# Altium schematic sheet DebugCircuit.SchDoc
size A; SheetNumber: 7; SheetTotal: 8
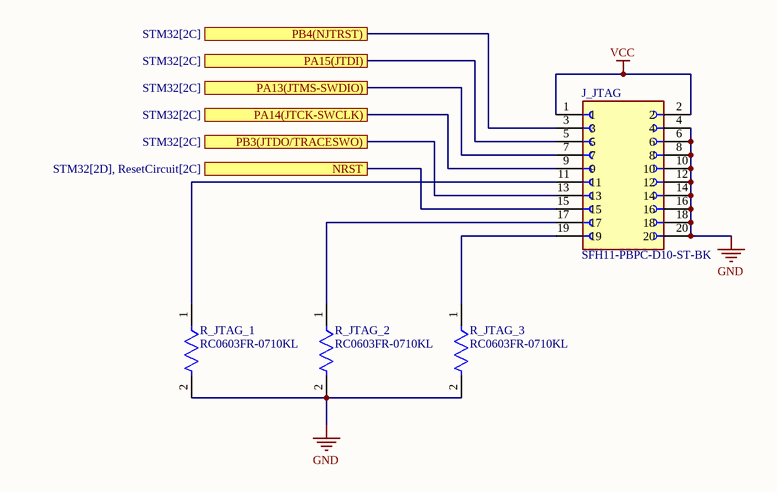
[diagram p0: DebugCircuit.SchDoc]

## Parts
J_JTAG  SFH11-PBPC-D10-ST-BK  [SULLINS_SFH11-PBPC-D10-ST-BK]
R_JTAG_1  RC0603FR-0710KL  [FP-RC0603-0_55-IPC_C]
R_JTAG_2  RC0603FR-0710KL  [FP-RC0603-0_55-IPC_C]
R_JTAG_3  RC0603FR-0710KL  [FP-RC0603-0_55-IPC_C]

## Ports
NRST (see STM32[2D], ResetCircuit[2C]), PA13(JTMS-SWDIO) (see STM32[2C]), PA14(JTCK-SWCLK) (see STM32[2C]), PA15(JTDI) (see STM32[2C]), PB3(JTDO/TRACESWO) (see STM32[2C]), PB4(NJTRST) (see STM32[2C])

## Nets
GND: J_JTAG.4 J_JTAG.6 J_JTAG.8 J_JTAG.10 J_JTAG.12 J_JTAG.14 J_JTAG.16 J_JTAG.18 J_JTAG.20 R_JTAG_1.2 R_JTAG_2.2 R_JTAG_3.2
VCC: J_JTAG.1 J_JTAG.2
NRST: J_JTAG.15 ; port NRST
PA13(JTMS-SWDIO): J_JTAG.7 ; port PA13(JTMS-SWDIO)
PA14(JTCK-SWCLK): J_JTAG.9 ; port PA14(JTCK-SWCLK)
PA15(JTDI): J_JTAG.5 ; port PA15(JTDI)
PB3(JTDO/TRACESWO): J_JTAG.13 ; port PB3(JTDO/TRACESWO)
PB4(NJTRST): J_JTAG.3 ; port PB4(NJTRST)
NetJ_JTAG_11: J_JTAG.11 R_JTAG_1.1
NetJ_JTAG_17: J_JTAG.17 R_JTAG_2.1
NetJ_JTAG_19: J_JTAG.19 R_JTAG_3.1

## Library data of the parts
J_JTAG = SFH11-PBPC-D10-ST-BK: 20 Position Header Connector 0.100 (2.54mm) Through Hole Gold; MF: Sullins Connector; Package: None; Price: None; Check_prices: https://www.snapeda.com/parts/SFH11-PBPC-D10-ST-BK/Sullins+Connector+Solutions/view-part/?ref=eda; Value: *; SnapEDA_Link: https://www.snapeda.com/parts/SFH11-PBPC-D10-ST-BK/Sullins+Connector+Solutions/view-part/?ref=snap; MP: SFH11-PBPC-D10-ST-BK; Availability: In Stock; Purchase-URL: https://pricing.snapeda.com/search?q=SFH11-PBPC-D10-ST-BK&ref=eda
R_JTAG_1-R_JTAG_3 = CMP-2100-03664-2: RES 10K OHM 1% 1/10W 0603; Voltage Rating: 75V; Voltage Rating (DC): 50V; Resistance: 10kR; Power Rating: 100mW; Temperature Coefficient: 100ppm/°C; Depth: 0.8mm; Termination: SMD/SMT; Resistor Type: Thick Film; Series: RC; Construction: Rectangular; Features: Moisture Resistant; Packaging: Tape and Reel; Min Operating Temperature: -55°C; Number of Terminations: 2; Lead Pitch: 0.3mm; RoHS Compliant: Yes; Case/Package: 0603; Resistance Tolerance: 1%; Military Standard: Not; Weight: 7.1E-05oz; Number of Pins: 2; Tolerance: 1%; Length: 1.6mm; Case Code (Imperial): 0603; Lead Free: Lead Free; Width: 0.8mm; Max Power Dissipation: 100mW; Height: 0.45mm; Max Operating Temperature: 155°C; Case Code (Metric): 1608; Size Code: 0603